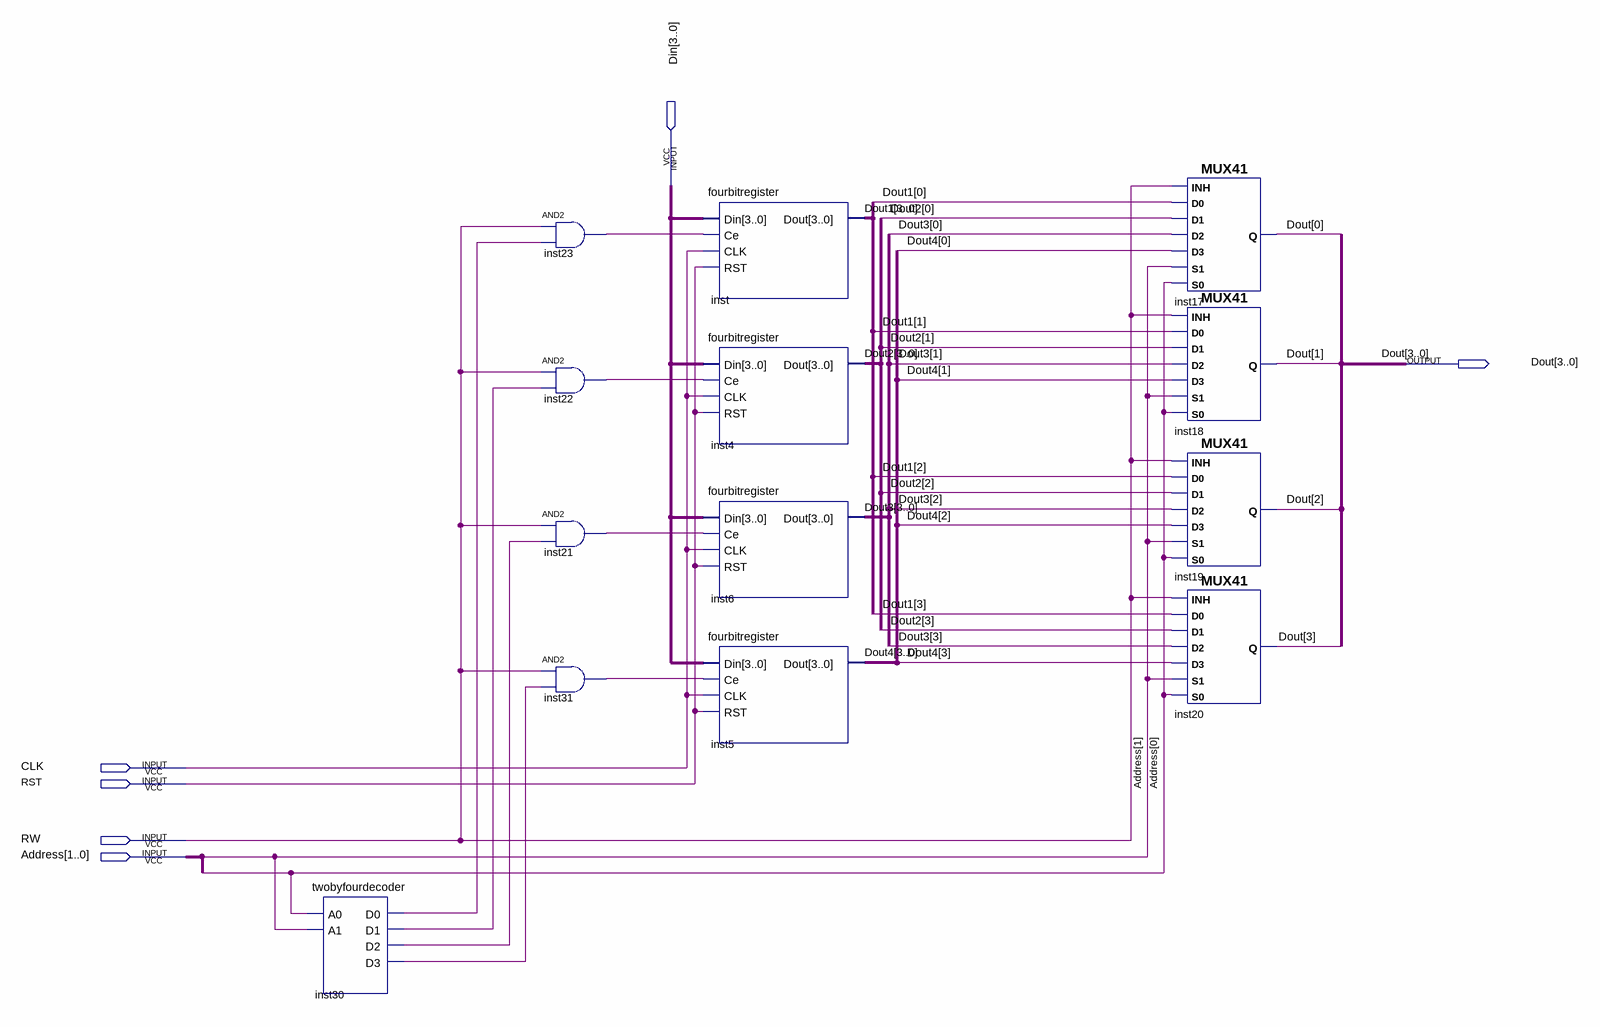
[diagram p0: schematic sheet]
// Quartus schematic week5_ex2.bdf as structural Verilog: 13 symbols, 6 pins
module week5_ex2 (
  input  [3:0] Din,
  input  CLK,
  input  RST,
  input  RW,
  input  [1:0] Address,
  output [3:0] Dout
);

  wire inst21_out, inst22_out, inst23_out, inst30_d0, inst30_d1, inst30_d2, inst30_d3, inst31_out;
  wire [3:0] Dout1, Dout2, Dout3, Dout4;

  twobyfourdecoder inst30 (
    .A0(Address[0]), .A1(Address[1]), .D0(inst30_d0), .D1(inst30_d1), .D2(inst30_d2), .D3(inst30_d3));
  and inst23 (inst23_out, RW, inst30_d0);
  and inst22 (inst22_out, RW, inst30_d1);
  and inst21 (inst21_out, RW, inst30_d2);
  and inst31 (inst31_out, RW, inst30_d3);
  fourbitregister inst (.Din(Din), .Ce(inst23_out), .CLK(CLK), .RST(RST), .Dout(Dout1));
  fourbitregister inst4 (.Din(Din), .Ce(inst22_out), .CLK(CLK), .RST(RST), .Dout(Dout2));
  fourbitregister inst6 (.Din(Din), .Ce(inst21_out), .CLK(CLK), .RST(RST), .Dout(Dout3));
  fourbitregister inst5 (.Din(Din), .Ce(inst31_out), .CLK(CLK), .RST(RST), .Dout(Dout4));
  MUX41 inst17 (
    .S0(Address[0]), .D2(Dout3[0]), .S1(Address[1]), .D3(Dout4[0]), .D0(Dout1[0]), .INH(RW), .D1(Dout2[0]),
    .Q(Dout[0]));
  MUX41 inst18 (
    .S0(Address[0]), .D2(Dout3[1]), .S1(Address[1]), .D3(Dout4[1]), .D0(Dout1[1]), .INH(RW), .D1(Dout2[1]),
    .Q(Dout[1]));
  MUX41 inst19 (
    .S0(Address[0]), .D2(Dout3[2]), .S1(Address[1]), .D3(Dout4[2]), .D0(Dout1[2]), .INH(RW), .D1(Dout2[2]),
    .Q(Dout[2]));
  MUX41 inst20 (
    .S0(Address[0]), .D2(Dout3[3]), .S1(Address[1]), .D3(Dout4[3]), .D0(Dout1[3]), .INH(RW), .D1(Dout2[3]),
    .Q(Dout[3]));
endmodule
